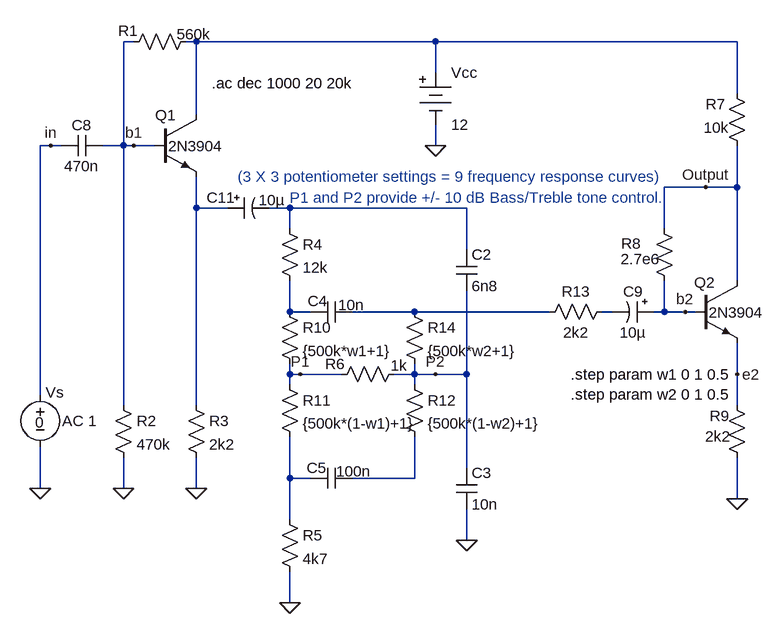
[diagram p0: schematic ToneControl.asc]
ToneControl.asc, the LTspice schematic file:
Version 4.1
SHEET 1 2024 848
WIRE 16 -240 0 -240
WIRE 112 -240 96 -240
WIRE 480 -240 112 -240
WIRE 944 -240 480 -240
WIRE 480 -192 480 -240
WIRE 944 -160 944 -240
WIRE 112 -128 112 -240
WIRE -112 -80 -128 -80
WIRE -96 -80 -112 -80
WIRE 0 -80 0 -240
WIRE 0 -80 -32 -80
WIRE 16 -80 0 -80
WIRE 48 -80 16 -80
WIRE 480 -80 480 -112
WIRE 896 -16 832 -16
WIRE 944 -16 944 -80
WIRE 944 -16 896 -16
WIRE 112 16 112 -32
WIRE 160 16 112 16
WIRE 256 16 224 16
WIRE 528 16 256 16
WIRE 256 48 256 16
WIRE 832 48 832 -16
WIRE 528 80 528 16
WIRE 944 128 944 -16
WIRE 256 176 256 128
WIRE 288 176 256 176
WIRE 448 176 352 176
WIRE 656 176 448 176
WIRE 752 176 736 176
WIRE 832 176 832 128
WIRE 832 176 816 176
WIRE 864 176 832 176
WIRE 880 176 864 176
WIRE 256 272 256 256
WIRE 272 272 256 272
WIRE 336 272 272 272
WIRE 448 272 448 256
WIRE 448 272 416 272
WIRE 480 272 448 272
WIRE 528 272 528 144
WIRE 528 272 480 272
WIRE 944 272 944 224
WIRE 256 288 256 272
WIRE 448 288 448 272
WIRE -128 304 -128 -80
WIRE 0 320 0 -80
WIRE 112 320 112 16
WIRE 944 320 944 272
WIRE 528 416 528 272
WIRE 256 432 256 368
WIRE 288 432 256 432
WIRE 448 432 448 368
WIRE 448 432 352 432
WIRE -128 448 -128 384
WIRE 0 448 0 400
WIRE 112 448 112 400
WIRE 944 464 944 400
WIRE 256 496 256 432
WIRE 528 528 528 480
WIRE 256 624 256 576
FLAG 944 464 0
FLAG 256 624 0
FLAG 528 528 0
FLAG 0 448 0
FLAG 112 448 0
FLAG -128 448 0
FLAG 480 -80 0
FLAG -112 -80 in
FLAG 944 272 e2
FLAG 864 176 b2
FLAG 16 -80 b1
FLAG 896 -16 Output
FLAG 272 272 P1
FLAG 480 272 P2
SYMBOL npn 48 -128 R0
WINDOW 0 1 1 Left 0
WINDOW 3 21 49 Left 0
SYMATTR InstName Q1
SYMATTR Value 2N3904
SYMBOL res 112 -256 R90
WINDOW 0 15 105 VBottom 0
WINDOW 3 -11 4 VTop 0
SYMATTR InstName R1
SYMATTR Value 560k
SYMBOL res -16 304 R0
SYMATTR InstName R2
SYMATTR Value 470k
SYMBOL res 96 304 R0
SYMATTR InstName R3
SYMATTR Value 2k2
SYMBOL res 240 32 R0
SYMATTR InstName R4
SYMATTR Value 12k
SYMBOL res 240 480 R0
SYMATTR InstName R5
SYMATTR Value 4k7
SYMBOL res 320 288 R270
WINDOW 0 16 6 VTop 0
WINDOW 3 45 104 VBottom 0
SYMATTR InstName R6
SYMATTR Value 1k
SYMBOL cap 512 80 R0
SYMATTR InstName C2
SYMATTR Value 6n8
SYMBOL cap 512 416 R0
SYMATTR InstName C3
SYMATTR Value 10n
SYMBOL cap 288 192 R270
WINDOW 0 17 11 VTop 0
WINDOW 3 42 63 VBottom 0
SYMATTR InstName C4
SYMATTR Value 10n
SYMBOL cap 288 448 R270
WINDOW 0 16 9 VTop 0
WINDOW 3 42 66 VBottom 0
SYMATTR InstName C5
SYMATTR Value 100n
SYMBOL npn 880 128 R0
WINDOW 0 -2 3 Left 0
WINDOW 3 20 49 Left 0
SYMATTR InstName Q2
SYMATTR Value 2N3904
SYMBOL res 928 -176 R0
WINDOW 0 -32 32 Left 0
WINDOW 3 -35 68 Left 0
SYMATTR InstName R7
SYMATTR Value 10k
SYMBOL res 816 32 R0
WINDOW 0 -50 39 Left 0
WINDOW 3 -51 63 Left 0
SYMATTR InstName R8
SYMATTR Value 2.7e6
SYMBOL res 928 304 R0
WINDOW 0 -26 32 Left 0
WINDOW 3 -33 64 Left 0
SYMATTR InstName R9
SYMATTR Value 2k2
SYMBOL cap -96 -64 R270
WINDOW 0 32 32 VTop 0
WINDOW 3 0 32 VBottom 0
SYMATTR InstName C8
SYMATTR Value 470n
SYMBOL voltage -128 288 R0
WINDOW 123 34 56 Left 0
WINDOW 39 24 160 Left 0
WINDOW 0 8 12 Left 0
WINDOW 3 -8 58 Left 0
SYMATTR Value2 AC 1
SYMATTR InstName Vs
SYMATTR Value 0
SYMBOL polcap 816 160 R90
WINDOW 0 0 32 VBottom 0
WINDOW 3 32 32 VTop 0
SYMATTR InstName C9
SYMATTR Value 10µ
SYMBOL polcap 160 0 M90
WINDOW 0 16 -10 VBottom 0
WINDOW 3 -12 68 VTop 0
SYMATTR InstName C11
SYMATTR Value 10µ
SYMBOL Misc\\battery 480 -208 R0
SYMATTR InstName Vcc
SYMATTR Value 12
SYMBOL res 640 192 R270
WINDOW 0 32 56 VTop 0
WINDOW 3 0 56 VBottom 0
SYMATTR InstName R13
SYMATTR Value 2k2
SYMBOL res 240 160 R0
SYMATTR InstName R10
SYMATTR Value {500k*w1+1}
SYMBOL res 240 272 R0
SYMATTR InstName R11
SYMATTR Value {500k*(1-w1)+1}
SYMBOL res 432 272 R0
SYMATTR InstName R12
SYMATTR Value {500k*(1-w2)+1}
SYMBOL res 432 160 R0
SYMATTR InstName R14
SYMATTR Value {500k*w2+1}
TEXT 136 -176 Left 0 !.ac dec 1000 20 20k
TEXT 688 272 Left 0 !.step param w1 0 1 0.5\n.step param w2 0 1 0.5
TEXT 256 0 Left 0 ;P1 and P2 provide +/- 10 dB Bass/Treble tone control.
TEXT 176 -32 Left 0 ;(3 X 3 potentiometer settings = 9 frequency response curves)

The netlist it stands for:
* ToneControl.asc
Q1 N001 b1 N002 0 2N3904
R1 N001 b1 560k
R2 b1 0 470k
R3 N002 0 2k2
R4 N003 N004 12k
R5 N007 0 4k7
R6 P1 P2 1k
C2 N003 P2 6n8
C3 P2 0 10n
C4 N004 N005 10n
C5 N007 N008 100n
Q2 Output b2 e2 0 2N3904
R7 N001 Output 10k
R8 Output b2 2.7e6
R9 e2 0 2k2
C8 in b1 470n
Vs in 0 0 AC 1
C9 b2 N006 10µ
C11 N002 N003 10µ
Vcc N001 0 12
R13 N005 N006 2k2
R10 N004 P1 {500k*w1+1}
R11 P1 N007 {500k*(1-w1)+1}
R12 P2 N008 {500k*(1-w2)+1}
R14 N005 P2 {500k*w2+1}
.model NPN NPN
.model PNP PNP
.lib standard.bjt
.ac dec 1000 20 20k
.step param w1 0 1 0.5
.step param w2 0 1 0.5
* P1 and P2 provide +/- 10 dB Bass/Treble tone control.
* (3 X 3 potentiometer settings = 9 frequency response curves)
.backanno
.end